# Altium schematic sheet secon_analog_in.SchDoc: foxBMS BMS-Slave 12-Cell
size A3; DocumentNumber: 16; SheetNumber: 16; SheetTotal: 21; AUTHOR: Fraunhofer IISB foxBMS Team; SheetDescription: Secondary Analog Inputs
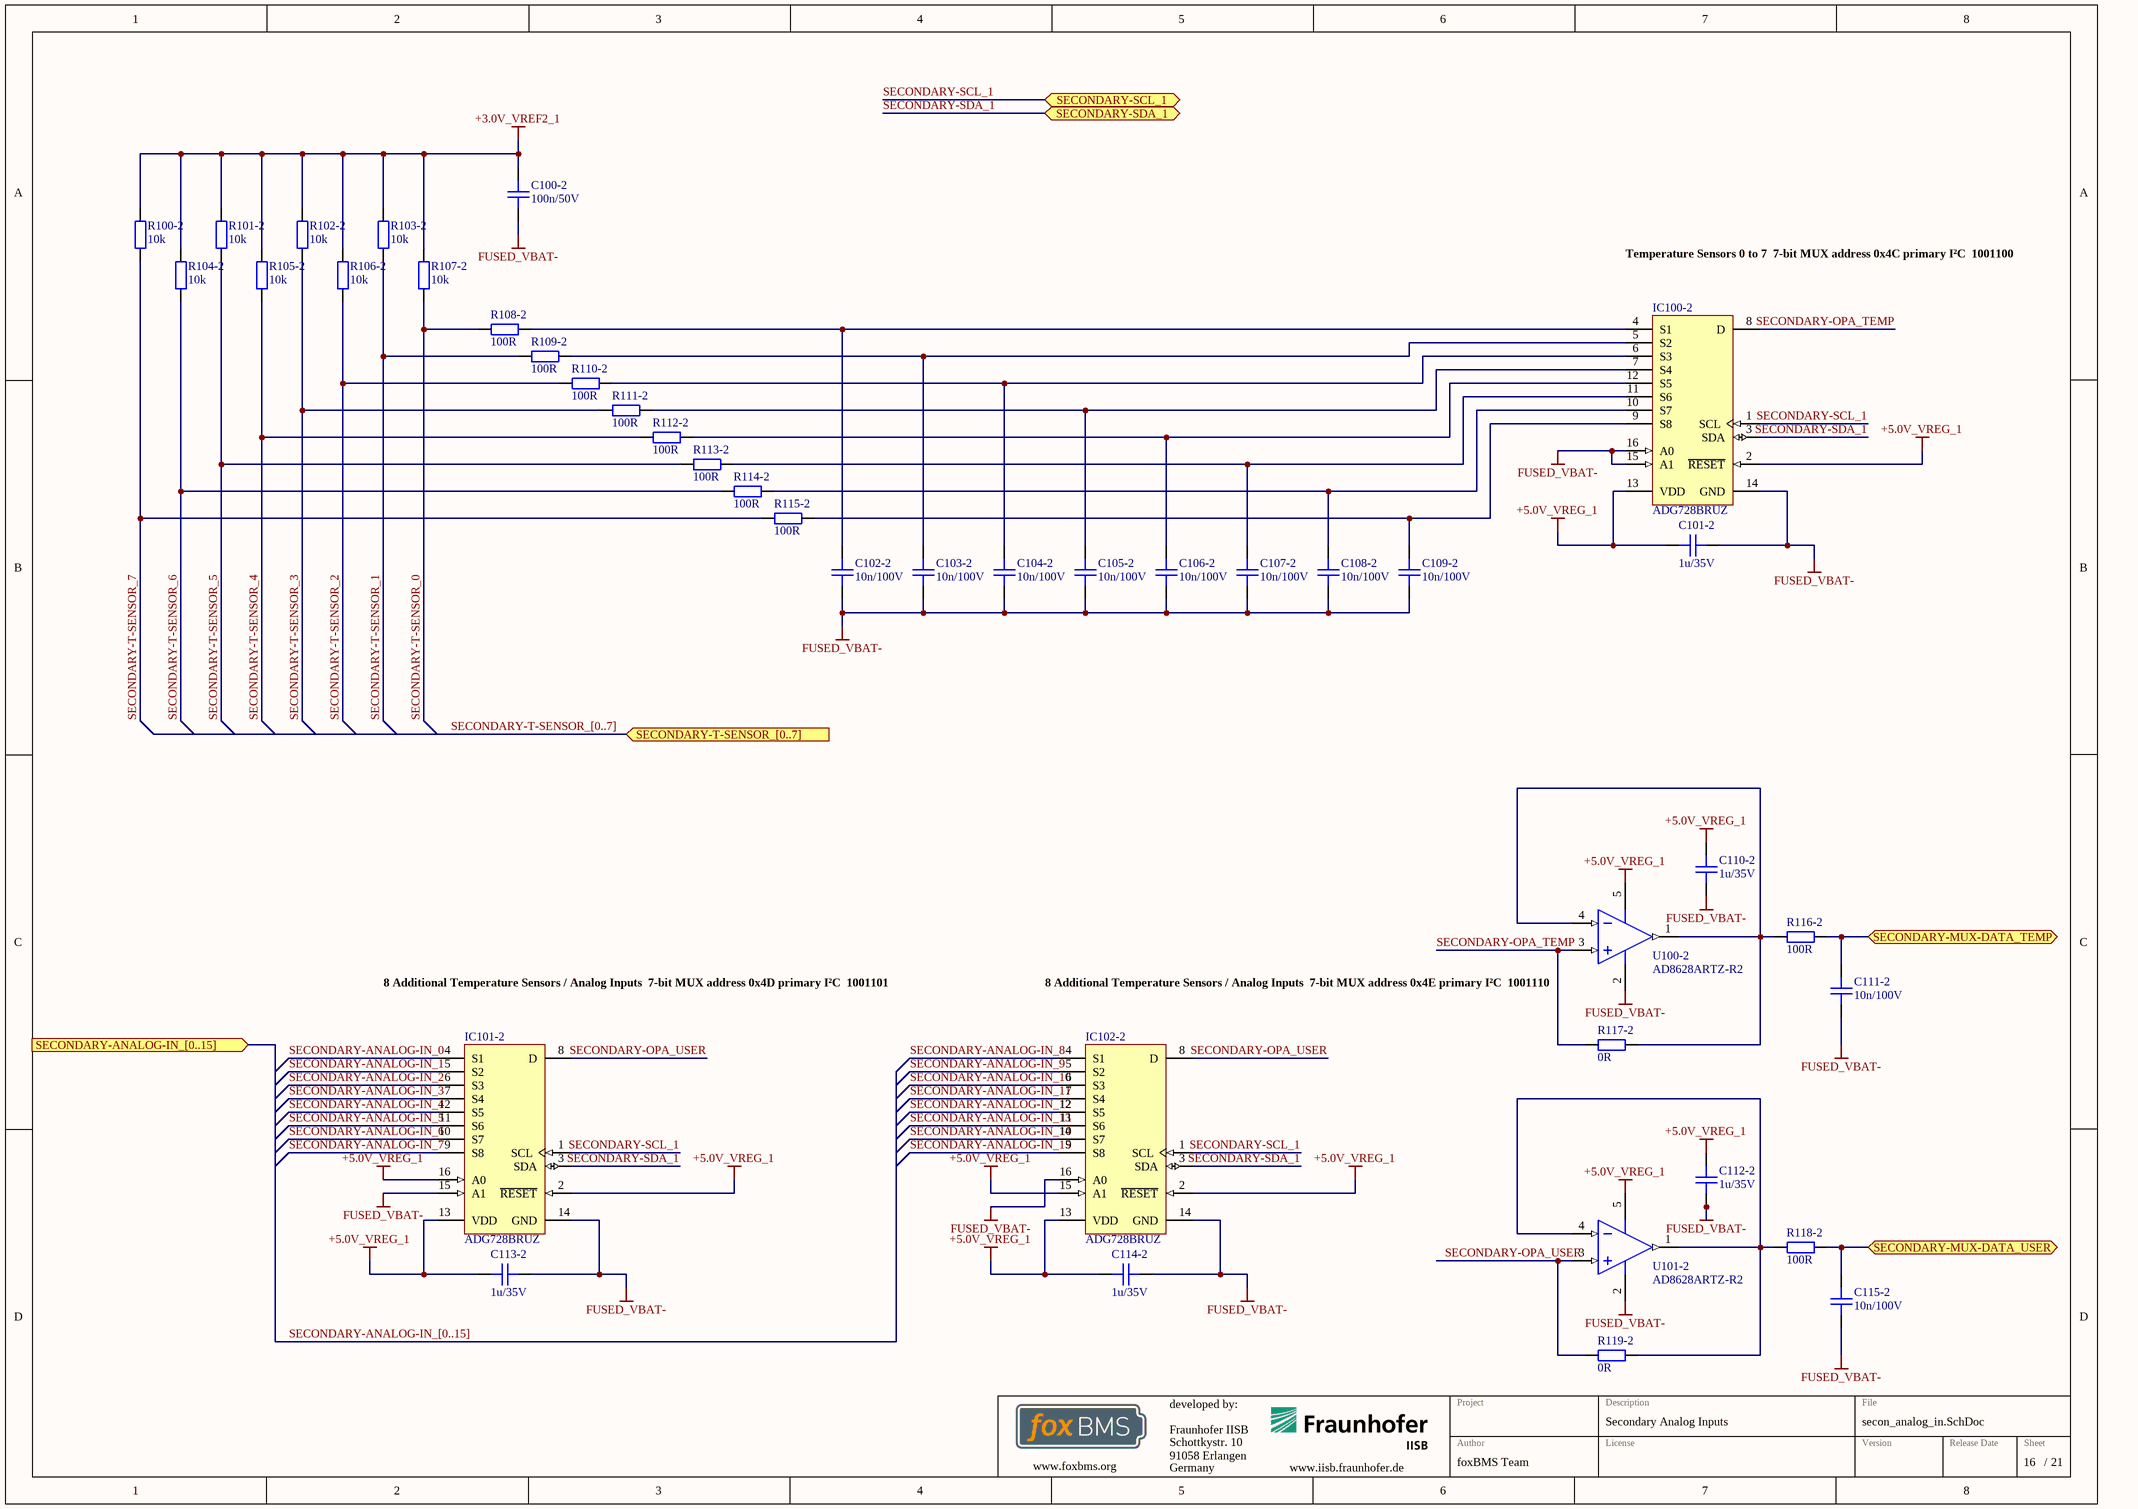
[diagram p0: secon_analog_in.SchDoc]

## Parts
C100-2  100n/50V  [CAPC1608X08N]
C101-2  1u/35V  [CAPC1608X08N]
C102-2  10n/100V  [CAPC1608X08N]
C103-2  10n/100V  [CAPC1608X08N]
C104-2  10n/100V  [CAPC1608X08N]
C105-2  10n/100V  [CAPC1608X08N]
C106-2  10n/100V  [CAPC1608X08N]
C107-2  10n/100V  [CAPC1608X08N]
C108-2  10n/100V  [CAPC1608X08N]
C109-2  10n/100V  [CAPC1608X08N]
C110-2  1u/35V  [CAPC1608X08N]
C111-2  10n/100V  [CAPC1608X08N]
C112-2  1u/35V  [CAPC1608X08N]
C113-2  1u/35V  [CAPC1608X08N]
C114-2  1u/35V  [CAPC1608X08N]
C115-2  10n/100V  [CAPC1608X08N]
IC100-2  ADG728BRUZ  [ADI-RU-16_M]
IC101-2  ADG728BRUZ  [ADI-RU-16_M]
IC102-2  ADG728BRUZ  [ADI-RU-16_M]
R100-2  10k  [RESC1608X05N]
R101-2  10k  [RESC1608X05N]
R102-2  10k  [RESC1608X05N]
R103-2  10k  [RESC1608X05N]
R104-2  10k  [RESC1608X05N]
R105-2  10k  [RESC1608X05N]
R106-2  10k  [RESC1608X05N]
R107-2  10k  [RESC1608X05N]
R108-2  100R  [RESC1608X05N]
R109-2  100R  [RESC1608X05N]
R110-2  100R  [RESC1608X05N]
R111-2  100R  [RESC1608X05N]
R112-2  100R  [RESC1608X05N]
R113-2  100R  [RESC1608X05N]
R114-2  100R  [RESC1608X05N]
R115-2  100R  [RESC1608X05N]
R116-2  100R  [RESC1608X05N]
R117-2  0R  [RESC1608X05N]
R118-2  100R  [RESC1608X05N]
R119-2  0R  [RESC1608X05N]
U100-2  AD8628ARTZ-R2  [ADI-RJ-5_M]
U101-2  AD8628ARTZ-R2  [ADI-RJ-5_M]

## Ports
SECONDARY-ANALOG-IN_[0..15] (in), SECONDARY-MUX-DATA_TEMP (bidir), SECONDARY-MUX-DATA_USER (bidir), SECONDARY-SCL_1 (bidir), SECONDARY-SDA_1 (bidir), SECONDARY-T-SENSOR_[0..7] (in)

## Nets
+3.0V_VREF2_1: C100-2.2 R100-2.2 R101-2.2 R102-2.2 R103-2.2 R104-2.2 R105-2.2 R106-2.2 R107-2.2
+5.0V_VREG_1: C101-2.2 C110-2.2 C112-2.2 C113-2.2 C114-2.2 IC100-2.2(~{RESET}) IC100-2.13(VDD) IC101-2.2(~{RESET}) IC101-2.13(VDD) IC101-2.16(A0) IC102-2.2(~{RESET}) IC102-2.13(VDD) IC102-2.15(A1) U100-2.5(+V) U101-2.5(+V)
FUSED_VBAT-: C100-2.1 C101-2.1 C102-2.1 C103-2.1 C104-2.1 C105-2.1 C106-2.1 C107-2.1 C108-2.1 C109-2.1 C110-2.1 C111-2.1 C112-2.1 C113-2.1 C114-2.1 C115-2.1 IC100-2.14(GND) IC100-2.15(A1) IC100-2.16(A0) IC101-2.14(GND) IC101-2.15(A1) IC102-2.14(GND) IC102-2.16(A0) U100-2.2(-V) U101-2.2(-V)
SECONDARY-ANALOG-IN_0: IC101-2.4(S1)
SECONDARY-ANALOG-IN_1: IC101-2.5(S2)
SECONDARY-ANALOG-IN_2: IC101-2.6(S3)
SECONDARY-ANALOG-IN_3: IC101-2.7(S4)
SECONDARY-ANALOG-IN_4: IC101-2.12(S5)
SECONDARY-ANALOG-IN_5: IC101-2.11(S6)
SECONDARY-ANALOG-IN_6: IC101-2.10(S7)
SECONDARY-ANALOG-IN_7: IC101-2.9(S8)
SECONDARY-ANALOG-IN_8: IC102-2.4(S1)
SECONDARY-ANALOG-IN_9: IC102-2.5(S2)
SECONDARY-ANALOG-IN_10: IC102-2.6(S3)
SECONDARY-ANALOG-IN_11: IC102-2.7(S4)
SECONDARY-ANALOG-IN_12: IC102-2.12(S5)
SECONDARY-ANALOG-IN_13: IC102-2.11(S6)
SECONDARY-ANALOG-IN_14: IC102-2.10(S7)
SECONDARY-ANALOG-IN_15: IC102-2.9(S8)
SECONDARY-MUX-DATA_TEMP: C111-2.2 R116-2.2 ; port SECONDARY-MUX-DATA_TEMP
SECONDARY-MUX-DATA_USER: C115-2.2 R118-2.2 ; port SECONDARY-MUX-DATA_USER
SECONDARY-OPA_TEMP: IC100-2.8(D) R117-2.1 U100-2.3(+IN)
SECONDARY-OPA_USER: IC101-2.8(D) IC102-2.8(D) R119-2.1 U101-2.3(+IN)
SECONDARY-SCL_1: IC100-2.1(SCL) IC101-2.1(SCL) IC102-2.1(SCL) ; port SECONDARY-SCL_1
SECONDARY-SDA_1: IC100-2.3(SDA) IC101-2.3(SDA) IC102-2.3(SDA) ; port SECONDARY-SDA_1
SECONDARY-T-SENSOR_0: R107-2.1 R108-2.2
SECONDARY-T-SENSOR_1: R103-2.1 R109-2.2
SECONDARY-T-SENSOR_2: R106-2.1 R110-2.2
SECONDARY-T-SENSOR_3: R102-2.1 R111-2.2
SECONDARY-T-SENSOR_4: R105-2.1 R112-2.2
SECONDARY-T-SENSOR_5: R101-2.1 R113-2.2
SECONDARY-T-SENSOR_6: R104-2.1 R114-2.2
SECONDARY-T-SENSOR_7: R100-2.1 R115-2.2
NetC102-2_2: C102-2.2 IC100-2.4(S1) R108-2.1
NetC103-2_2: C103-2.2 IC100-2.5(S2) R109-2.1
NetC104-2_2: C104-2.2 IC100-2.6(S3) R110-2.1
NetC105-2_2: C105-2.2 IC100-2.7(S4) R111-2.1
NetC106-2_2: C106-2.2 IC100-2.12(S5) R112-2.1
NetC107-2_2: C107-2.2 IC100-2.11(S6) R113-2.1
NetC108-2_2: C108-2.2 IC100-2.10(S7) R114-2.1
NetC109-2_2: C109-2.2 IC100-2.9(S8) R115-2.1
NetR116-2_1: R116-2.1 R117-2.2 U100-2.1(OUT) U100-2.4(-IN)
NetR118-2_1: R118-2.1 R119-2.2 U101-2.1(OUT) U101-2.4(-IN)

## Buses and harness runs
bus SECONDARY-ANALOG-IN_[0..15] = port SECONDARY-ANALOG-IN_[0..15]
bus SECONDARY-T-SENSOR_[0..7] = port SECONDARY-T-SENSOR_[0..7]

## Notes on the sheet
- Temperature Sensors 0 to 7
  7-bit MUX address 0x4C primary I²C
  1001100
- 8 Additional Temperature Sensors / Analog Inputs
  7-bit MUX address 0x4D primary I²C
  1001101
- (near U100-2) 8 Additional Temperature Sensors / Analog Inputs
  7-bit MUX address 0x4E primary I²C
  1001110
- Fraunhofer IISB
- Schottkystr. 10
- developed by:
- 91058 Erlangen
- Germany
- Author
- Project
- License
- Description
- File
- Version
- Release Date
- Sheet
- www.foxbms.org
- www.iisb.fraunhofer.de
- foxBMS Team
- /

## Library data of the parts
C100-2 = gen_C_ceramic_100n_50V_X7R_0603: MLCC; Capacitance: 100n; Rated Voltage: 50V; Dielectric: X7R; Case EIA: 0603; Case Metric: 1608; PnP Package: C_0603_10; PnP Value: 100n/50V/X7R; PnP equipped: x; Automotive Qualified: True; Part Number: gen_C_ceramic_100n_50V_X7R_0603; Supplier 1: Farnell; Supplier Part Number 1: 2525267; Supplier 2: Digikey; Supplier Part Number 2: 490-6049-1-ND; Supplier 3: Farnell; Supplier Part Number 3: 2070398
C101-2 C110-2 C112-2 C113-2 C114-2 = gen_C_ceramic_1u_35V_X7R_0603: MLCC; Capacitance: 1u; Rated Voltage: 35V; Dielectric: X7R; Case EIA: 0603; Case Metric: 1608; PnP Package: C_0603_10; PnP Value: 1uF/35V/X7R; PnP equipped: x; Automotive Qualified: False; Part Number: gen_C_ceramic_1u_35V_X7R_0603; Supplier 1: Farnell; Supplier Part Number 1: 1907508
C102-2 C103-2 C104-2 C105-2 C106-2 C107-2 C108-2 C109-2 C111-2 C115-2 = gen_C_ceramic_10n_100V_X7R_0603: MLCC; Capacitance: 10n; Rated Voltage: 100V; Dielectric: X7R; Case EIA: 0603; Case Metric: 1608; Automotive Qualified: True; PnP Package: C_0603_10; PnP Value: 10n/100V/X7R; Part Number: gen_C_ceramic_10n_100V_X7R_0603; Supplier 1: Farnell; Supplier Part Number 1: 1301715; Supplier 2: Farnell; Supplier Part Number 2: 2821192; Supplier 3: Farnell; Supplier Part Number 3: 2210878
IC100-2 IC101-2 IC102-2 = CMP-0798-00197-1: CMOS, Low Voltage, 2-Wire Serially Controlled, Matrix Switch, -40 to 85 degC, 16-pin SOP (RU-16), Tube; Manufacturer: Analog Devices; Ron (ohms): 2.5; Supply V Guar Performance: Single_(+3V), Single_(+5V); Max Analog Signal Range: 0 to Vdd; Bandwidth (Hz): 65M; ComponentLink3Description: Package Specification; Packing: Tube; PartNumber: ADG728BRUZ; ComponentLink1URL: http://www.analog.com/en/index.html; Mounting Technology: Surface Mount; DatasheetVersion: Rev. C; ComponentLink1Description: Manufacturer URL; ComponentLink3URL: http:/www.analog.com/static/imported-files/packages/36244347913743854010197452789RU16.pdf; ComponentLink2URL: http://www.analog.com/static/imported-files/data_sheets/ADG728_729.pdf; PackageVersion: Nov-02; PackageDescription: 16-Pin Thin Shrink Small Outline Package, Body 5 x 4.4 mm, Pitch 0.65 mm; Code_JEDEC: MO-153AB; PackageReference: RU-16; ComponentLink2Description: Datasheet
R100-2 R101-2 R102-2 R103-2 R104-2 R105-2 R106-2 R107-2 = gen_R_10k_0603: SMD Resistor 10k 0603; Tolerance: 1%; Power: 0.1W; Case EIA: 0603; Case Metric: 1608; Maximum Working Voltage: 75V; PnP Package: R_0603; Automotive Qualified: True; Part Number: gen_R_10k_0603; Operating Temperature: -55°C - +155°C; Resistance: 10k; Series: E24, E96; PnP Value: 10k; Supplier 1: Farnell; Supplier Part Number 1: 2073349
R108-2 R109-2 R110-2 R111-2 R112-2 R113-2 R114-2 R115-2 = gen_R_100R_0603: SMD Resistor 100R 0603; Tolerance: 1%; Power: 0.1W; Case EIA: 0603; Case Metric: 1608; Maximum Working Voltage: 75V; PnP Package: R_0603; Automotive Qualified: True; Part Number: gen_R_100R_0603; Operating Temperature: -55°C - +155°C; Resistance: 100R; Series: E24, E96; PnP Value: 100R; Supplier 1: Digikey; Supplier Part Number 1: P100HCT-ND
R116-2 R118-2 = gen_R_100R_0603: SMD Resistor 100R 0603; Tolerance: 1%; Power: 0.1W; Case EIA: 0603; Case Metric: 1608; Maximum Working Voltage: 75V; PnP Package: R_0603; Automotive Qualified: False; Part Number: gen_R_100R_0603; Operating Temperature: -55°C - +155°C; Resistance: 100R; Series: E24, E96; PnP Value: 100R; Supplier 1: Farnell; Supplier Part Number 1: 1469752
R117-2 R119-2 = gen_R_0R_0603: SMD Resistor 0R 0603; Power: 0.1W; Case EIA: 0603; Case Metric: 1608; Maximum Working Voltage: 75V; PnP Package: R_0603; Automotive Qualified: True; Part Number: gen_R_0R_0603; Operating Temperature: -55°C - +155°C; Resistance: 0R; Series: Jumper; PnP Value: 0R; Supplier 1: Farnell; Supplier Part Number 1: 2616580
U100-2 U101-2 = CMP-0384-01512-2: Single Channel RRIO Operational Amplifier, 2.5 MHz BW, 1 V/us SR, Industrial, 5-pin SOT23 (RJ-5), Reel; Manufacturer: Analog Devices; Generic Part Number: AD8628; Iq/Amp: 1.1mA; Automotive Qualified: Yes; V Span Max: 6V; Input Bias Current: 30pA; Slew Rate: 1V/us; Amplifiers Per Package: 1; Input Offset Voltage: 1uV; Small Signal Bandwidth: 2.5MHz; V Span Min: 2.7V; ComponentLink1Description: Manufacturer URL; DatasheetVersion: Rev. I; ComponentLink4Description: Reference Circuit; Code_JEDEC: MO-178-AA; PackageDescription: 5-Pin Small Outline Transistor Package, Body 2.9 x 1.6 mm, Pitch 0.95 mm; ComponentLink3URL: http://www.analog.com/static/imported-files/packages/PKG_PDF/SOT-23(RJ)/RJ_5.pdf; PackageReference: RJ-5; ComponentLink1URL: http://www.analog.com/en/index.html; PackageVersion: 121608-A; RevisionNote: Reference Circuit URL fixed; Mounting Technology: Surface Mount; ComponentLink2Description: Datasheet; ComponentLink3Description: Package Specification; ComponentLink4URL: http://www.analog.com/en/all-operational-amplifiers-op-amps/operational-amplifiers-op-amps/ad8628/products/product.html#product-recommendations; ComponentLink2URL: http://www.analog.com/static/imported-files/data_sheets/AD8628_8629_8630.pdf; PartNumber: AD8628ARTZ-R2